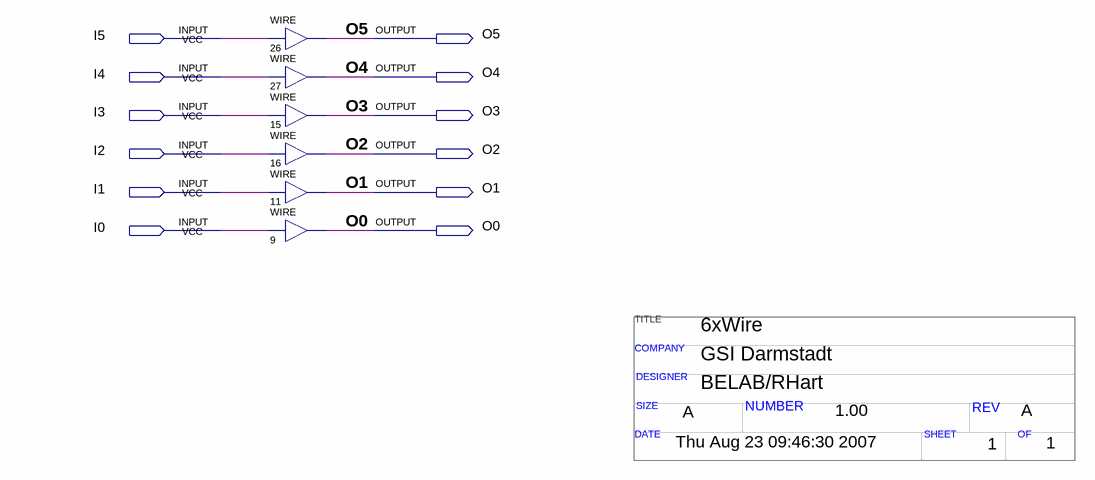
[diagram p0: schematic sheet]
// Quartus schematic 6xwire.bdf as structural Verilog: 6 symbols, 12 pins
// Title block: TITLE: 6xWire; COMPANY: GSI Darmstadt; DESIGNER: BELAB/RHart; SIZE: A; NUMBER: 1.00; REV: A; DATE: Thu Aug 23 09:46:30 2007; SHEET: 1; OF: 1
module \6xwire  (
  input  I5,
  input  I4,
  input  I3,
  input  I2,
  input  I1,
  input  I0,
  output O5,
  output O4,
  output O3,
  output O2,
  output O1,
  output O0
);

  assign O5 = I5;  // WIRE 26
  assign O4 = I4;  // WIRE 27
  assign O3 = I3;  // WIRE 15
  assign O2 = I2;  // WIRE 16
  assign O1 = I1;  // WIRE 11
  assign O0 = I0;  // WIRE 9
endmodule
